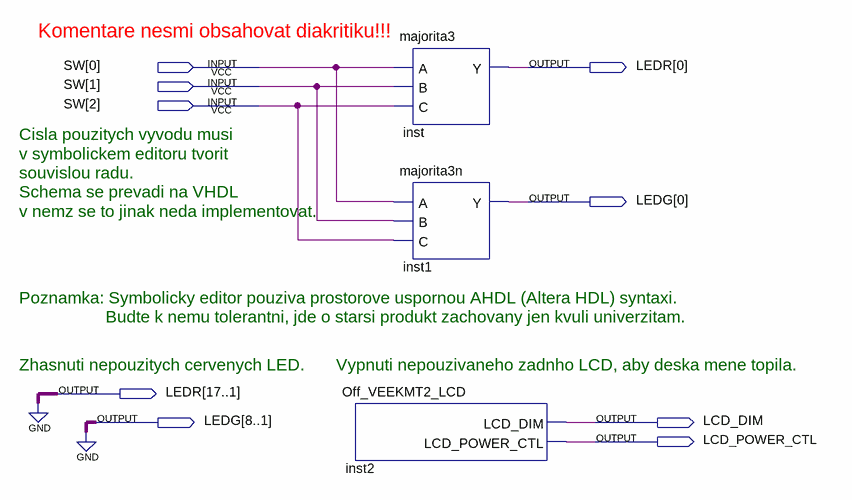
[diagram p0: schematic sheet]
// Quartus schematic TestMajorityNaDesce.bdf as structural Verilog: 3 symbols, 9 pins
module TestMajorityNaDesce (
  input  [2:0] SW,
  output [17:0] LEDR,
  output [8:0] LEDG,
  output LCD_DIM,
  output LCD_POWER_CTL
);

  majorita3 inst (.A(SW[0]), .B(SW[1]), .C(SW[2]), .Y(LEDR[0]));
  majorita3n inst1 (.A(SW[0]), .B(SW[1]), .C(SW[2]), .Y(LEDG[0]));
  Off_VEEKMT2_LCD inst2 (.LCD_DIM(LCD_DIM), .LCD_POWER_CTL(LCD_POWER_CTL));

  assign LEDG[8:1] = {8{1'b0}};
  assign LEDR[17:1] = {17{1'b0}};

  // Notes on the sheet:
  //   Komentare nesmi obsahovat diakritiku!!!
  //   Cisla pouzitych vyvodu musi
  //   v symbolickem editoru tvorit
  //   souvislou radu.
  //   Schema se prevadi na VHDL
  //   v nemz se to jinak neda implementovat.
  //   Poznamka: Symbolicky editor pouziva prostorove uspornou AHDL (Altera HDL) syntaxi.
  //   Budte k nemu tolerantni, jde o starsi produkt zachovany jen kvuli univerzitam.
  //   Zhasnuti nepouzitych cervenych LED.
  //   Vypnuti nepouzivaneho zadnho LCD, aby deska mene topila.
endmodule
